# Altium schematic sheet top.SchDoc
size 420 x 297 mm; SheetNumber: 1; SheetTotal: 1
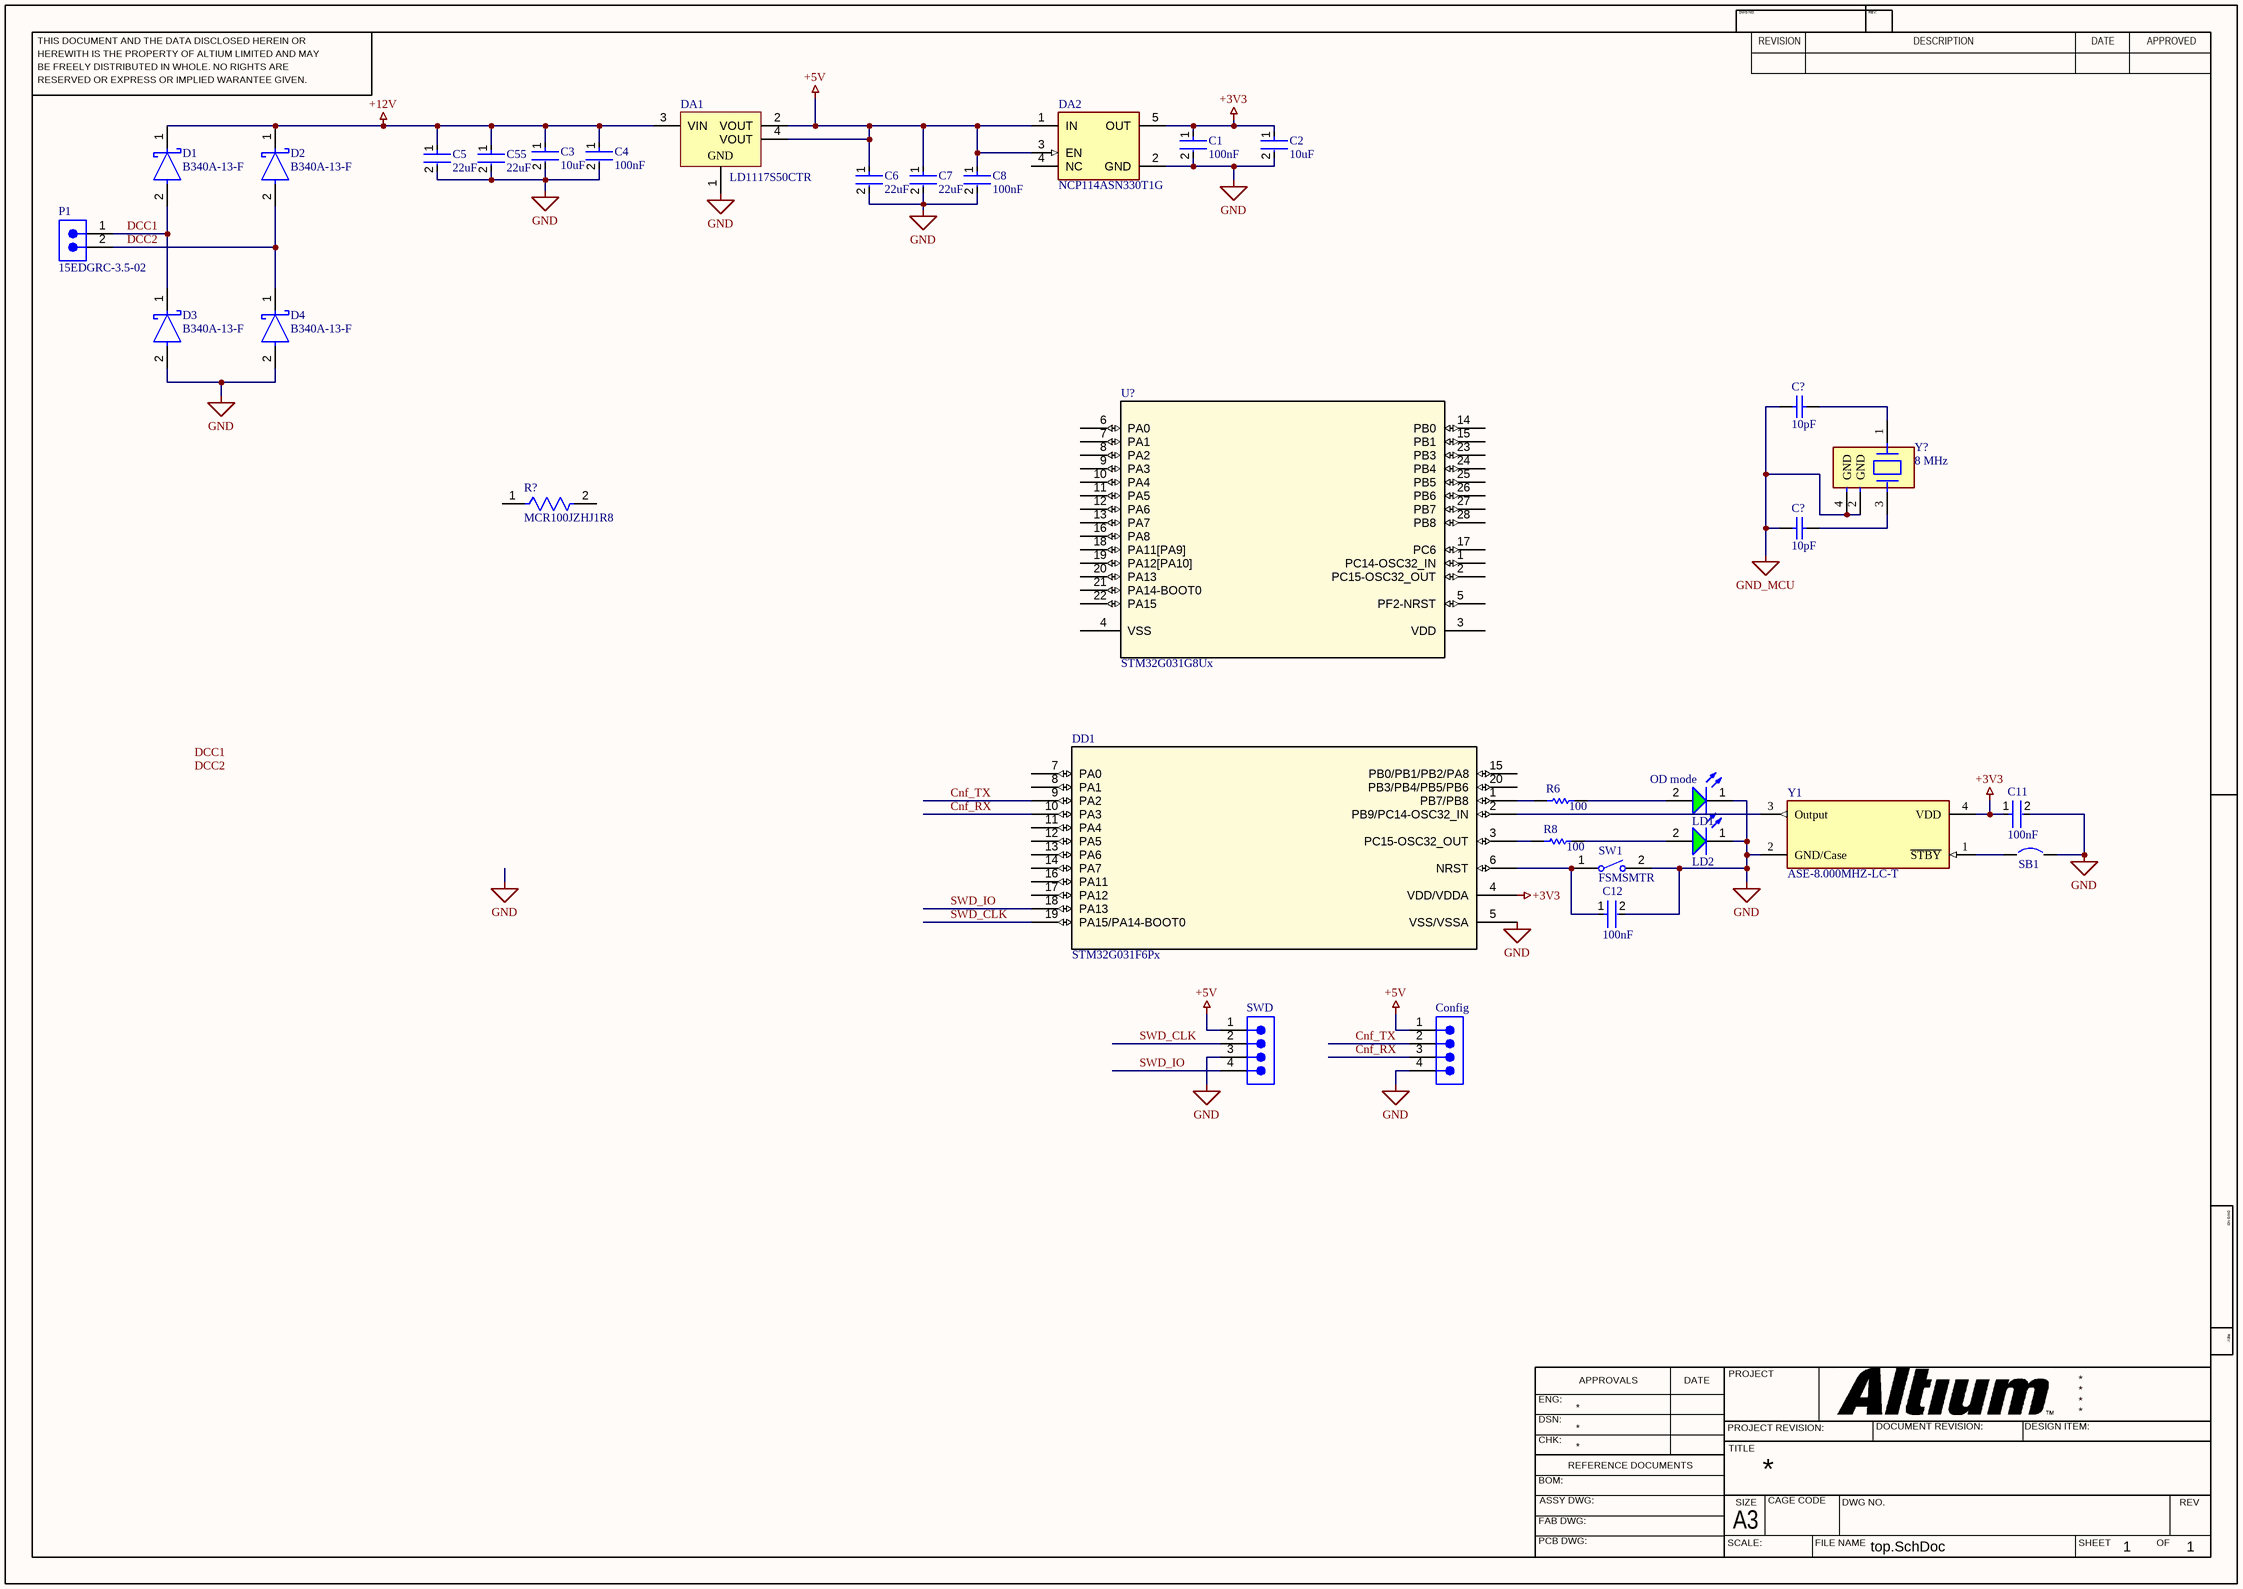
[diagram p0: top.SchDoc]

## Parts
(Parts that share a designator on the sheet are numbered #1, #2 ... from top to bottom, then left to right.)
C1  Capacitance: 100nF  [FP-CGA3E-0_3-0_1-IPC_C]  (hidden comment: CGA3E2X7R1H104K080AA)
C2  Capacitance: 10uF  [FP-GRM188-0_1-e0_2_0_55-IPC_C]  (hidden comment: GRM188R60J106ME47D)
C3  Capacitance: 10uF  [FP-GRM188-0_1-e0_2_0_55-IPC_C]  (hidden comment: GRM188R60J106ME47D)
C4  Capacitance: 100nF  [FP-CGA3E-0_3-0_1-IPC_C]  (hidden comment: CGA3E2X7R1H104K080AA)
C5  Capacitance: 22uF  [FP-GRM188-0_2-IPC_C]  (hidden comment: GRM188R61A226ME15D)
C6  Capacitance: 22uF  [FP-GRM188-0_2-IPC_C]  (hidden comment: GRM188R61A226ME15D)
C7  Capacitance: 22uF  [FP-GRM188-0_2-IPC_C]  (hidden comment: GRM188R61A226ME15D)
C8  Capacitance: 100nF  [FP-CGA3E-0_3-0_1-IPC_C]  (hidden comment: CGA3E2X7R1H104K080AA)
C11  Capacitance: 100nF  [FP-CGA3E-0_3-0_1-IPC_C]  (hidden comment: CGA3E2X7R1H104K080AA)
C12  Capacitance: 100nF  [FP-CGA3E-0_3-0_1-IPC_C]  (hidden comment: CGA3E2X7R1H104K080AA)
C55  Capacitance: 22uF  [FP-GRM188-0_2-IPC_C]  (hidden comment: GRM188R61A226ME15D)
C?#1  value 10pF  [CAPC0603(1608)100_N]  (hidden comment: CAP 10pF 25V 0603(1608))
C?#2  value 10pF  [CAPC0603(1608)100_N]  (hidden comment: CAP 10pF 25V 0603(1608))
Config  61300411121  [61300411121]  (value not drawn)
D1  B340A-13-F  [FP-SMA-MFG]
D2  B340A-13-F  [FP-SMA-MFG]
D3  B340A-13-F  [FP-SMA-MFG]
D4  B340A-13-F  [FP-SMA-MFG]
DA1  LD1117S50CTR  [SOT-223_N]
DA2  NCP114ASN330T1G  [FP-483-MFG]
DD1  STM32G031F6Px  [TSSOP20]
LD1  150060VS75000  [WL-SMCW_0603_150060xx75000]  (value not drawn)
LD2  150060VS75000  [WL-SMCW_0603_150060xx75000]  (value not drawn)
P1  15EDGRC-3.5-02  [691305140002]
R6  value 100  [RESC1608X55X30NL15T15]  (hidden comment: ERJ-3EKF1003V)
R8  value 100  [RESC1608X55X30NL15T15]  (hidden comment: ERJ-3EKF1003V)
R?  MCR100JZHJ1R8  [FP-MCR100-IPC_C]
SB1  (no value)  [JP_SMD]
SW1  FSMSMTR  [TECO-FSMSMTR_V]
SWD  61300411121  [61300411121]  (value not drawn)
U?  STM32G031G8Ux  [UFQFPN-28]
Y1  ASE-8.000MHZ-LC-T  [FP-ASE-MFG]
Y?  8 MHz  [FP-7M-MFG]

## Nets
+3V3: C1.1 C2.1 C11.1 DA2.5(OUT) DD1.4(VDD/VDDA) Y1.4(VDD)
+5V: C6.1 C7.1 C8.1 Config.1 DA1.2(VOUT) DA1.4(VOUT) DA2.1(IN) DA2.3(EN) SWD.1
+12V: C3.1 C4.1 C5.1 C55.1 D1.1(C) D2.1(C) DA1.3(VIN)
GND: C1.2 C2.2 C3.2 C4.2 C5.2 C6.2 C7.2 C8.2 C11.2 C12.2 C55.2 Config.4 D3.2(A) D4.2(A) DA1.1(GND) DA2.2(GND) DD1.5(VSS/VSSA) LD1.1(K) LD2.1(K) SB1.2 SW1.2 SWD.3 Y1.2(GND/Case)
GND_MCU: C?#1.2 C?#2.2 Y?.2(GND) Y?.4(GND)
Cnf_RX: Config.3 DD1.10(PA3)
Cnf_TX: Config.2 DD1.9(PA2)
DCC1: D1.2(A) D3.1(C) P1.1
DCC2: D2.2(A) D4.1(C) P1.2
SWD_CLK: DD1.19(PA15/PA14-BOOT0) SWD.2
SWD_IO: DD1.18(PA13) SWD.4
NetC12_1: C12.1 DD1.6(NRST) SW1.1
NetC?#1_1: C?#1.1 Y?.1
NetC?#2_1: C?#2.1 Y?.3
NetDD1_1: DD1.1(PB7/PB8) R6.1
NetDD1_2: DD1.2(PB9/PC14-OSC32_IN) Y1.3(Output)
NetDD1_3: DD1.3(PC15-OSC32_OUT) R8.1
NetLD1_2: LD1.2(A) R6.2
NetLD2_2: LD2.2(A) R8.2
NetSB1_1: SB1.1 Y1.1(~{STBY})

Not connected (* = marked no-connect by the designer): DA2 4(NC); DD1 7(PA0) 8(PA1) 11(PA4) 12(PA5) 13(PA6) 14(PA7) 15(PB0/PB1/PB2/PA8) 16(PA11) 17(PA12) 20(PB3/PB4/PB5/PB6); R? 1 2; U? 1(PC14-OSC32_IN) 2(PC15-OSC32_OUT) 3(VDD) 4(VSS) 5(PF2-NRST) 6(PA0) 7(PA1) 8(PA2) 9(PA3) 10(PA4) 11(PA5) 12(PA6) 13(PA7) 14(PB0) 15(PB1) 16(PA8) 17(PC6) 18(PA11[PA9]) 19(PA12[PA10]) 20(PA13) 21(PA14-BOOT0) 22(PA15) 23(PB3) 24(PB4) 25(PB5) 26(PB6) 27(PB7) 28(PB8)

## Notes on the sheet
- (near LD1) OD mode
- Labels drawn without touching a wire or pin: DCC1, DCC2
- THIS DOCUMENT AND THE DATA DISCLOSED HEREIN OR
- HEREWITH IS THE PROPERTY OF ALTIUM LIMITED AND MAY
- DWG NO:
- REVISION
- REV:
- DESCRIPTION
- DATE
- APPROVED
- BE FREELY DISTRIBUTED IN WHOLE. NO RIGHTS ARE
- RESERVED OR EXPRESS OR IMPLIED WARANTEE GIVEN.
- ENG:
- APPROVALS
- PROJECT
- DSN:
- CHK:
- REFERENCE DOCUMENTS
- PROJECT REVISION:
- TITLE
- DOCUMENT REVISION:
- DESIGN ITEM:
- BOM:
- FAB DWG:
- PCB DWG:
- ASSY DWG:
- SCALE:
- A3
- SIZE
- CAGE CODE
- FILE NAME
- DWG NO.
- SHEET
- OF
- REV

## Library data of the parts
C1 C4 C8 C11 C12 = CMP-2000-07546-2: Cap Ceramic 100nF 50V X7R 10% Pad SMD 0603 +125°C Automotive T/R; Weight: 7.1E-05oz; Composition: Ceramic; Max Operating Temperature: 125°C; Termination: SMD/SMT; Dielectric: X7R; Length: 1.6mm; Package Quantity: 1; REACH SVHC: No SVHC; Lead Free: Lead Free; Case Code (Metric): 1608; Min Operating Temperature: -55°C; Packaging: Tape and Reel; Tolerance: 10%; Voltage Rating: 50V; Case Code (Imperial): 0603; Case/Package: 0603; Voltage Rating (DC): 50V; Depth: 0.8mm; Radiation Hardening: No; Ratings: AEC-Q200; Mount: Surface Mount; Voltage: 50V; Thickness: 0.035inch; Width: 0.8mm; Height: 0.8mm
C2 C3 = CMP-2006-02792-2: Chip Multilayer Ceramic Capacitors for General Purpose, 0603, 10uF, X5R, 15%, 20%, 6.3V; Packaging: Tape and Reel; Voltage Rating (DC): 6.3V; Width: 0.031inch; Termination: SMD/SMT; Dielectric: X5R; Package Quantity: 4000; Voltage Rating: 6.3V; Case/Package: 0603; Min Operating Temperature: -55°C; Voltage: 6.3V; Length: 1.6mm; Thickness: 0.035inch; Lead Free: Lead Free; Depth: 0.8mm; Case Code (Imperial): 0603; Max Operating Temperature: 85°C; Material: Ceramic; Height: 0.8mm; Tolerance: 20%; Mount: Surface Mount; REACH SVHC: No SVHC; Radiation Hardening: No; Case Code (Metric): 1608
C5-C7 C55 = CMP-2000-06337-3: Chip Multilayer Ceramic Capacitors for General Purpose, 0603, 22uF, X5R, 15%, 20%, 10V; Tolerance: 20%; Weight: 0.000222oz; Material: Ceramic; Depth: 0.8mm; Length: 1.6mm; Termination: SMD/SMT; Packaging: Tape and Reel; Width: 0.8mm; Voltage Rating: 10V; Case Code (Imperial): 0603; Mount: Surface Mount; Voltage Rating (DC): 10V; Case/Package: 0603; Thickness: 0.039inch; REACH SVHC: No SVHC; Dielectric: X5R; Height: 0.8mm; Package Quantity: 4000; Case Code (Metric): 1608; Min Operating Temperature: -55°C; Lead Free: Lead Free; Max Operating Temperature: 85°C
C?#1 C?#2 = CMP-1035-00549-1: CAP 10pF 25V ±1% 0603 (1608 Metric) Thickness 1mm SMD; Case-EIA: 0603; Case-Metric: 1608; Tolerance: Â±1%; Technology: SMT; Max Thickness: 1 mm; Rated Voltage: 25 V
Config SWD = CMP-1502-01064-3: NexarPartId: 32855522; Operating Supply Voltage: 250V; Pitch: 2.54mm; Contact Resistance: 20mΩ; Number of Positions: 4; Current Rating: 3A; Connector Type: Male Pin; Gender: Male; Contact Plating: Gold; Height: 8.89mm; Lead Pitch: 2.54mm; Lead Free: Lead Free; Contact Mating Length: 5.9944mm; Number of Rows: 1; Termination: Solder; Packaging: Bulk; REACH SVHC: Unknown; Min Operating Temperature: -40°C; RoHS: Compliant; Number of Contacts: 4; Voltage Rating: 250V; Color: Black; Max Operating Temperature: 105°C; Contact Material: Copper; Mount: Through Hole; Orientation: Vertical; Number of Pins: 4
D1-D4 = CMP-1667-00003-3: DIODE SCHOTTKY 40V 3A SMA; Max Forward Surge Current (Ifsm): 80A; Forward Voltage: 500mV; Polarity: Standard; Max Reverse Current: 500uA; Capacitance: 250pF; Element Configuration: Single; Mount: Surface Mount; Output Current: 3A; Radiation Hardening: No; Width: 2.92mm; Current Rating: 3A; Termination: SMD/SMT; Voltage: 40V; Series: -; Max Operating Temperature: 125°C; Current: 3A; Max Repetitive Reverse Voltage (Vrrm): 40V; Min Operating Temperature: -55°C; REACH SVHC: No SVHC; Number of Pins: 2; Average Rectified Current: 3A; Contact Plating: Tin; RoHS Compliant: Yes; Max Reverse Voltage (DC): 40V; Packaging: Tape and Reel; Height: 2.3mm; Length: 4.6mm; Case/Package: SMA; Weight: 0.002258oz; Peak Non-Repetitive Surge Current: 80A; Package Quantity: 5000; Lead Free: Lead Free; Forward Current: 3A; Voltage Rating (DC): 40V
DA1 = CMP-0244-00311-1: Fixed Low Drop Positive Voltage Regulator, 5V, 4-Pin SOT-223, Tape and Reel; PackageReference: SOT-223; PackageVersion: 2010; ComponentLink2URL: http://www.st.com/internet/com/TECHNICAL_RESOURCES/TECHNICAL_LITERATURE/DATASHEET/CD00000544.pdf; ComponentLink1URL: http://www.st.com; ComponentLink2Description: Datasheet; DatasheetVersion: 1/11/2011; ComponentLink1Description: Manufacturer URL; PackageDescription: 4-Pin SOT-223 Package, 6.5 x 3.5 mm Body, 2.3 mm Pitch, 7 mm Lead Span
DA2 = CMP-07128-000001-1: IC REG LINEAR 3.3V 300MA 5TSOP; Manufacturer: ON Semiconductor; Dropout Voltage: 150mV; Number Of Outputs: 1; Output Type: Fixed; Standoff Height: 0.01mm; Nominal Supply Current: 50uA; Accuracy Percentage: 1%; Max Junction Temp: +150°C; Min Supply Voltage: 1.7V; Max Supply Voltage: 5.5V; Output Voltage: 3.3V; Device Class L2: Power Management ICs; Digikey Description: IC REG LINEAR 3.3V 300MA 5TSOP; Footprint Url: https://www.onsemi.com/pub/Collateral/483.PDF; Temperature: to +150°C; RoHS: TRUE; Octopart: https://octopart.com/ncp114asn330t1g-on+semiconductor-74628742; Package: 483; Height: 1.1mm; Device Class L1: Integrated Circuits (ICs); Device Class L3: Voltage Regulators - Linear; ComponentLink2URL: https://www.onsemi.com/pub/Collateral/NCP114-D.PDF; Output Current: 300mA; Automotive: No; ComponentLink2Description: Datasheet; Manufacturer Part Number: NCP114ASN330T1G; Category: IC; Lead Free: Yes; Temperature Range High: +150°C
DD1 = STM32G031F6Px: The STM32G031x4/x6/x8 mainstream microcontrollers are based on high-performance Arm® Cortex®-M0+ 32-bit RISC core operating at up to 64 MHz frequency. / 32 Kbytes of Flash program memory and 8 Kbytes of SRAM. With 20pin TSSOP 6.4x4.4 package; Manufacturer_Part_Number: stm32g0_tssop20_t1; Vendor: STMicroelectronics; Copyright: Copyright (C) 2018 Accelerated Designs. All rights reserved; RefDes: RefDes; Type: DEV; Value: Value
LD1 LD2 = CMP-1426-00006-7: WURTH ELEKTRONIK - 150060VS75000 - LED, Green, SMD, 0603, 30 mA, 2 V, 570 nm; Reverse Voltage: 5V; Power Dissipation: 72mW; Dominant Wavelength: 570nm; Peak Wavelength: 572nm; Forward Current: 100mA; Forward Voltage: 2V; Lens Style: Clear, Rectangular; Test Current: 20mA; Max Junction Temperature (Tj): 95°C; Viewing Angle: 140°; Luminous Intensity: 40mcd; Height: 700µm; Width: 800µm; Length: 1.6mm; Mount: Surface Mount; Min Operating Temperature: -40°C; Max Reverse Voltage (DC): 5V; Case Code (Imperial): 0603; Wavelength: 570nm; Color: Green; REACH SVHC: Unknown; RoHS: Compliant; Max Operating Temperature: 85°C; Packaging: Tape and Reel; Case/Package: 0603; Number of Pins: 2; Case Code (Metric): 1608
P1 = CMP-1502-01775-2: NexarPartId: 78871375; Gender: Male; Number of Pins: 2; Packaging: Box; RoHS: Non-Compliant; Lead Pitch: 3.5mm
R6 R8 = CMP-2000-00182-1: Manufacturer: Panasonic; Part Number: ERJ-3EKF1003V
R? = CMP-08839-000552-1: Thick Film Chip Resistor, 2512, 1.8Ω, 5%, +850/+150ppm/°C, 1W, 200V; Resistance: 1.8R; Temperature Coefficient: 850ppm/°C; Min Operating Temperature: -55°C; Max Power Dissipation: 1W; Power Rating: 1W; Case Code (Imperial): 2512; Case/Package: 2512; Height: 0.55mm; Number of Terminations: 2; Features: Automotive AEC-Q200; Max Operating Temperature: 125°C; Series: MCR; Case Code (Metric): 6432; RoHS Compliant: Yes; Width: 3.2mm; Tolerance: 5%; Length: 6.3mm; Packaging: Tape and Reel; Voltage Rating (DC): 200V
SB1 = Circuit Breaker: Solder: NO; Published: 24-Mar-1999; Revision: July-2002: Re-released for DXP Platform.; Publisher: Altium Limited
SW1 = CMP-2000-07501-1: FSMSM Push Button Switch, 50 mA, -35 to 85 degC, 2-Pin SMD, RoHS, Tape and Reel; Manufacturer: TE Connectivity; Voltage Rating (DC): 24V; Electrical Life: 20000Cycles; Operating Force: 180gf; Switch Travel: 0.25mm; Contact Current Rating: 50mA; Case\/Package: SMD/SMT; Actuator Length: 1.07mm; Throw Configuration: SPST; Actuator Material: Polyamide; Contact Resistance: 100mOhm; Illumination Type: Illuminated; Max Voltage Rating (DC): 12V; Manufacturer URL: http://www.te.com/; Lead Free: LeadFree; Packaging: TapeandReel; Min Operating Temperature: -35degC; Mechanical Life: 20000Cycles; Mount: SurfaceMount; REACH SVHC: Unknown; Package Quantity: 1800; Package Reference: FSMSMTR; RoHSCompliant: true; Max Operating Temperature: 85degC; Orientation: Straight; ELV: Compliant; Datasheet URL: http://www.te.com/commerce/DocumentDelivery/DDEController?Action=showdoc&DocId=Customer+Drawing%7F1437566-3%7FC2%7Fpdf%7FEnglish%7FENG_CD_1437566-3_C2_1437566_3_1_c.dwg.pdf%7F1437566-4; Package Description: 2-Pin Surface Mount Device, Body 6 x 3.5 mm, Pitch 9.19 mm; Current Rating: 50mA; Contact Plating: Silver; Termination: GullWing; Datasheet Version: Rev. C2, 08/2014; Contact Material: Brass; Mounting Technology: SurfaceMount
U? = STM32G031G8Ux: The STM32G031x4/x6/x8 mainstream microcontrollers are based on high-performance Arm® Cortex®-M0+ 32-bit RISC core operating at up to 64 MHz frequency. / 64 Kbytes of Flash program memory and 8 Kbytes of SRAM. With 28pin UFQFPN 4x4x0.55 package; Manufacturer_Part_Number: stm32g0_ufqfpn28_t1; Built_By: EMA_Jessica; Vendor: STMicroelectronics; Copyright: Copyright (C) 2016 Accelerated Designs. All rights reserved; RefDes: RefDes; Type: DEV; Value: Value
Y1 = CMP-27762-006944-1: XTAL Oscillator 8MHz ±50ppm CMOS 3.3V 4-SMD 3.2mm x 2.5mm; Max Supply Current: 7mA; Max Supply Voltage: 3.465V; Min Supply Voltage: 3.135V; Load Capacitance: 15pF; Length: 3.2mm; REACH SVHC: No SVHC; Operating Supply Voltage: 3.3V; Frequency Stability: 50ppm; Height: 0.047inch; Width: 0.098inch; Number of Pins: 4; Package Quantity: 1000; Min Operating Temperature: -40°C; Operating Frequency: 8 MHz; Termination: SMD/SMT; Max Operating Temperature: 85°C; Frequency: 8MHz; Radiation Hardening: No; Depth: 2.5mm; Case/Package: SMD/SMT; Packaging: Tape and Reel; Mount: Surface Mount; Series: ASE; Lead Free: Lead Free
Y? = CMP-18717-000318-1: Crystal 24MHz, 10ppm, 10pF, 50Ω; ESR (Equivalent Series Resistance): 60R; Lead Free: Lead Free; Packaging: Tape and Reel; Length: 3.2mm; Frequency: 24MHz; Load Capacitance: 10pF; REACH SVHC: No SVHC; Width: 0.098inch; Height: 0.031inch; Tolerance: 10ppm; Frequency Stability: 10ppm; Min Operating Temperature: -20°C; Max Operating Temperature: 70°C; Frequency Tolerance: 10ppm; Number of Pins: 4; Mount: Surface Mount; Termination: SMD/SMT; Case/Package: SMD/SMT; Package Quantity: 3000; Depth: 2.5mm; Series: 7M